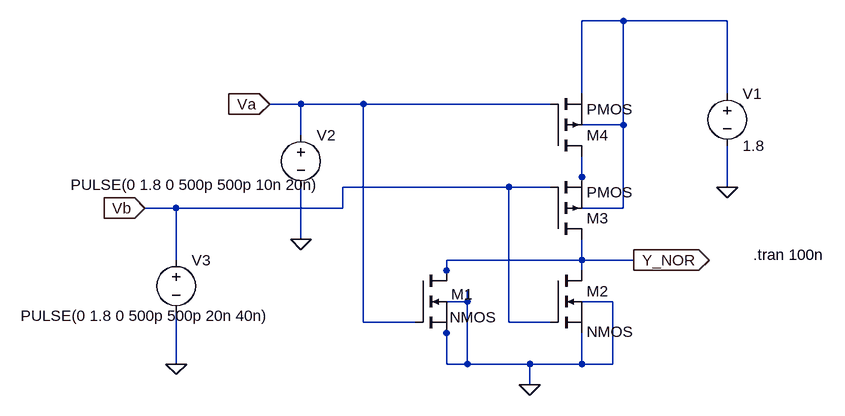
[diagram p0: schematic CMOS NOR.asc]
CMOS NOR.asc, the LTspice schematic file:
Version 4.1
SHEET 1 880 680
WIRE 400 -192 336 -192
WIRE 560 -192 400 -192
WIRE 336 -80 336 -192
WIRE 560 -80 560 -192
WIRE -96 -64 -144 -64
WIRE 0 -64 -96 -64
WIRE 288 -64 0 -64
WIRE 400 -32 400 -192
WIRE 400 -32 336 -32
WIRE -96 -16 -96 -64
WIRE 336 48 336 16
WIRE 224 64 -32 64
WIRE 288 64 224 64
WIRE 336 64 336 48
WIRE 560 64 560 0
WIRE -288 96 -336 96
WIRE -32 96 -32 64
WIRE -32 96 -288 96
WIRE 400 96 400 -32
WIRE 400 96 336 96
WIRE -96 144 -96 64
WIRE -288 176 -288 96
WIRE 336 176 336 144
WIRE 336 176 128 176
WIRE 416 176 336 176
WIRE 128 192 128 176
WIRE 336 192 336 176
WIRE 128 208 128 192
WIRE 160 240 160 224
WIRE 160 240 128 240
WIRE 384 240 336 240
WIRE 0 272 0 -64
WIRE 80 272 0 272
WIRE 224 272 224 64
WIRE 288 272 224 272
WIRE 128 288 128 272
WIRE -288 336 -288 256
WIRE 128 336 128 288
WIRE 160 336 160 240
WIRE 160 336 128 336
WIRE 256 336 160 336
WIRE 336 336 336 288
WIRE 336 336 256 336
WIRE 384 336 384 240
WIRE 384 336 336 336
WIRE 256 368 256 336
FLAG 256 368 0
FLAG -96 144 0
FLAG -288 336 0
FLAG -144 -64 Va
IOPIN -144 -64 In
FLAG -336 96 Vb
IOPIN -336 96 In
FLAG 416 176 Y_NOR
IOPIN 416 176 Out
FLAG 560 64 0
SYMBOL nmos 80 192 R0
WINDOW 3 53 72 Left 2
WINDOW 0 55 37 Left 2
SYMATTR InstName M1
SYMBOL nmos 288 192 R0
WINDOW 3 56 94 Left 2
SYMATTR InstName M2
SYMBOL pmos 288 144 M180
SYMATTR InstName M3
SYMBOL pmos 288 16 M180
SYMATTR InstName M4
SYMBOL voltage 560 -96 R0
WINDOW 123 0 0 Left 0
WINDOW 39 0 0 Left 0
SYMATTR InstName V1
SYMATTR Value 1.8
SYMBOL voltage -96 -32 R0
WINDOW 3 -354 92 Left 2
WINDOW 123 0 0 Left 0
WINDOW 39 0 0 Left 0
SYMATTR Value PULSE(0 1.8 0 500p 500p 10n 20n)
SYMATTR InstName V2
SYMBOL voltage -288 160 R0
WINDOW 3 -239 102 Left 2
WINDOW 123 0 0 Left 0
WINDOW 39 0 0 Left 0
SYMATTR Value PULSE(0 1.8 0 500p 500p 20n 40n)
SYMATTR InstName V3
TEXT 600 168 Left 2 !.tran 100n

The netlist it stands for:
* CMOS NOR.asc
M1 Y_NOR Va 0 0 NMOS
M2 Y_NOR Vb 0 0 NMOS
M3 Y_NOR Vb N002 N002 PMOS
M4 N002 Va N001 N001 PMOS
V1 N001 0 1.8
V2 Va 0 PULSE(0 1.8 0 500p 500p 10n 20n)
V3 Vb 0 PULSE(0 1.8 0 500p 500p 20n 40n)
.model NMOS NMOS
.model PMOS PMOS
.lib standard.mos
.tran 100n
.backanno
.end